# EAGLE schematic lora_mcu (EAGLE 9.5.2)
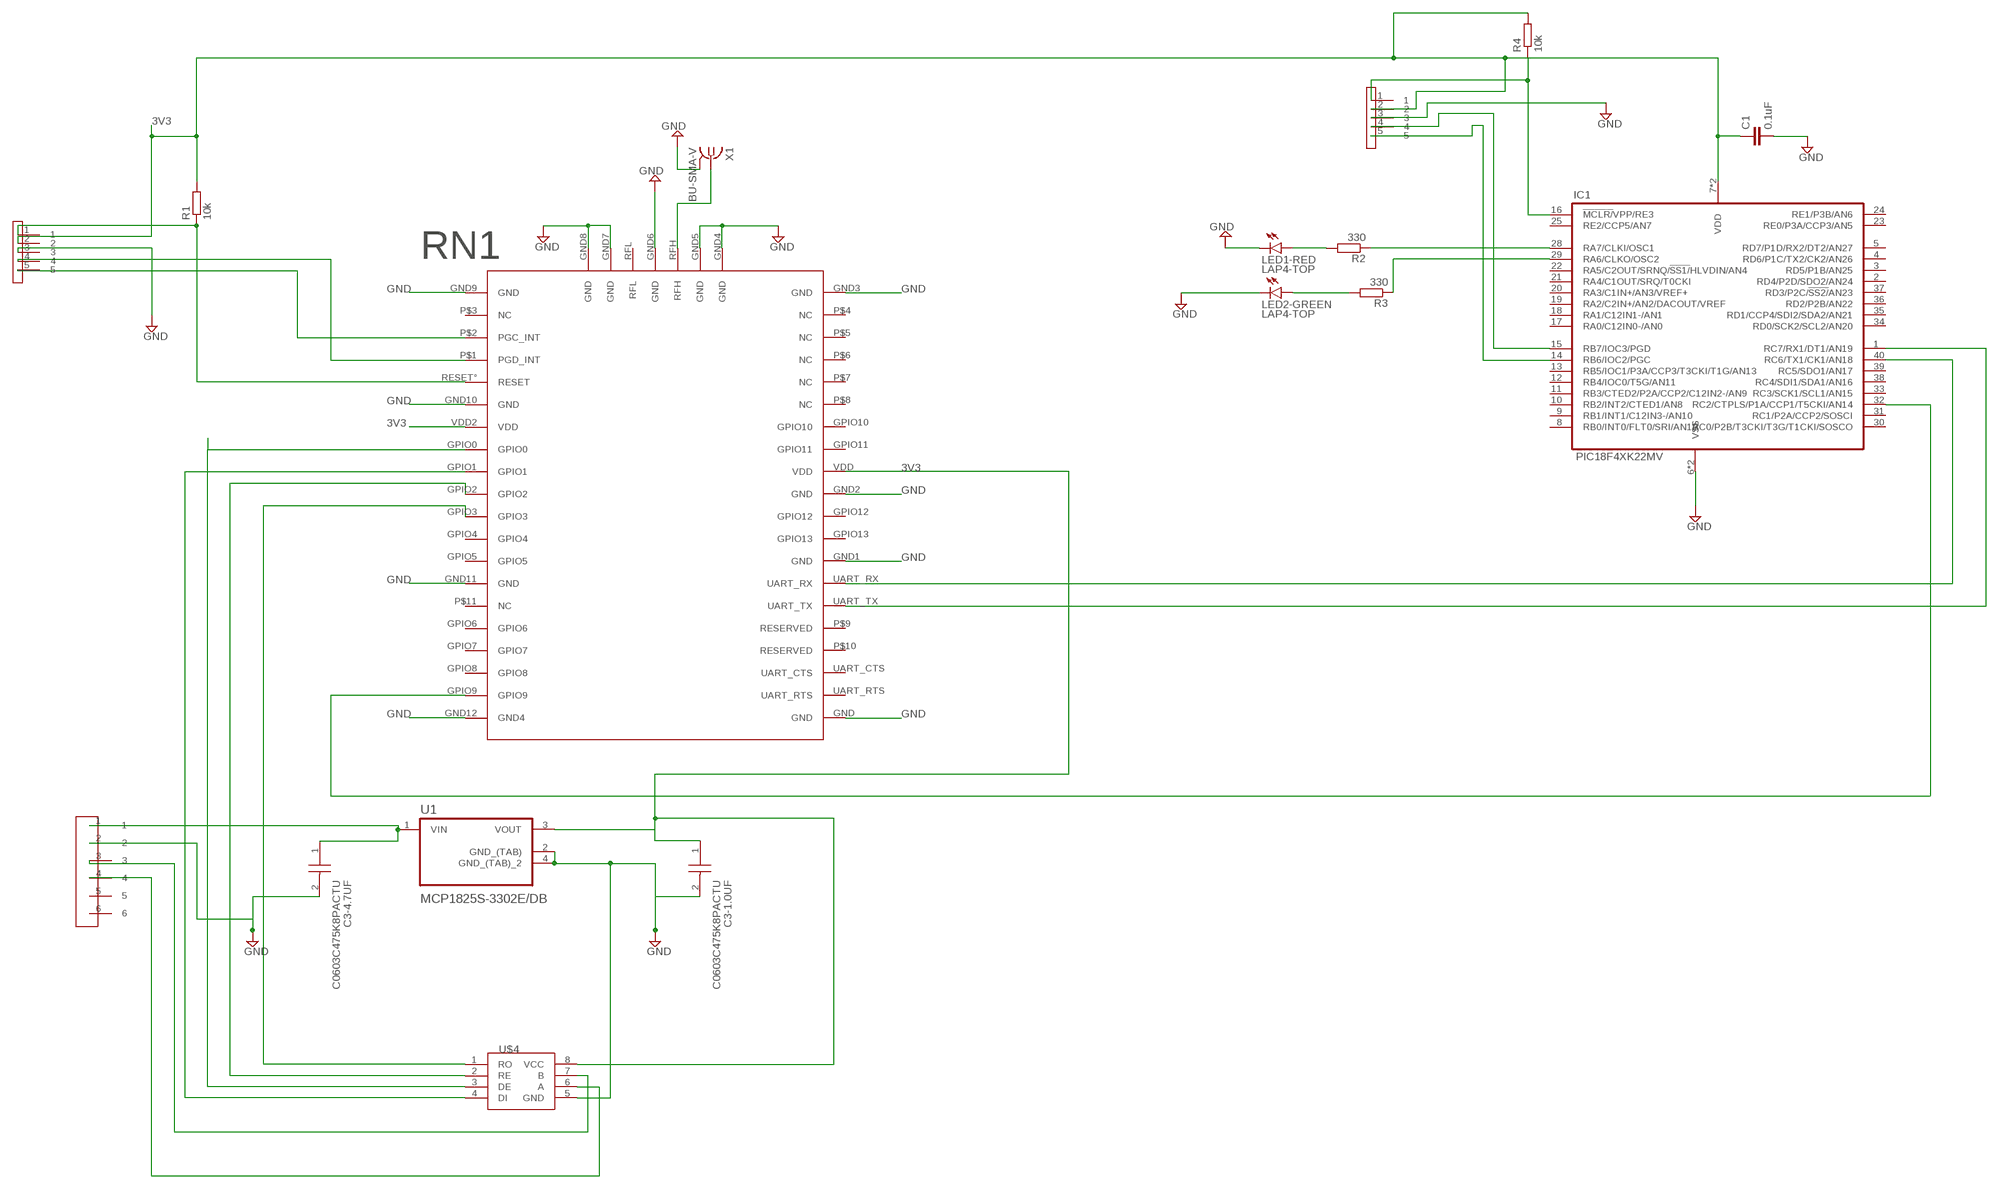
[diagram p0: schematic, sheet 1]

## Parts
C1  0.1uF  C2,5-3  [C2.5-3]
C3-1.0UF  C0603C475K8PACTU  [CAPC1608X85N]
C3-4.7UF  C0603C475K8PACTU  [CAPC1608X85N]
IC1  PIC18F4XK22MV  [UQFN40ML5X5MM]
LED1-RED  LAP4-TOP  [P47F-TOP]
LED2-GREEN  LAP4-TOP  [P47F-TOP]
R1  10k  R-EU_R0603  [R0603]
R2  330  R-EU_R0603  [R0603]
R3  330  R-EU_R0603  [R0603]
R4  10k  R-EU_R0603  [R0603]
RN1  NEW_RN2483  [NEW_RN2483]
U1  MCP1825S-3302E/DB  [SOT230P700X180-4N]
U$1  CONNECTOR6  [CONNECTOR6]
U$2  ICSP5  [ICSP]
U$3  ICSP5  [ICSP]
U$4  AMD3485E  [AMD3485E]
X1  BU-SMA-V  [BU-SMA-V]

## Nets
3V3: C1.1 C3-1.0UF.1(C1) IC1.7(VDD) IC1.26(VDD) R1.2 R4.2 RN1.VDD RN1.VDD2(VDD) U1.3(VOUT) U$2.2 U$3.2 U$4.8(VCC)
GND: C1.2 C3-1.0UF.2(C2) C3-4.7UF.2(C2) IC1.6(VSS) IC1.27(VSS) LED1-RED.C LED2-GREEN.C RN1.GND RN1.GND1(GND) RN1.GND2(GND) RN1.GND3(GND) RN1.GND4(GND) RN1.GND5(GND) RN1.GND6(GND) RN1.GND7(GND) RN1.GND8(GND) RN1.GND9(GND) RN1.GND10(GND) RN1.GND11(GND) RN1.GND12(GND4) U1.2(GND_(TAB)) U1.4(GND_(TAB)_2) U$1.2 U$2.3 U$3.3 U$4.5(GND) X1.2 X1.3 X1.4 X1.5
N$1: RN1.P$2(PGC_INT) U$2.5
N$2: RN1.P$1(PGD_INT) U$2.4
N$3: R1.1 RN1.RESET°(RESET) U$2.1
N$4: RN1.RFH X1.1
N$5: LED1-RED.A R2.2
N$6: LED2-GREEN.A R3.2
N$7: IC1.15(RB7/IOC3/PGD) U$3.4
N$8: C3-4.7UF.1(C1) U1.1(VIN) U$1.1
N$9: IC1.40(RC6/TX1/CK1/AN18) RN1.UART_RX
N$10: IC1.14(RB6/IOC2/PGC) U$3.5
N$11: IC1.16(!MCLR/!VPP/RE3) R4.1 U$3.1
N$12: IC1.29(RA6/CLKO/OSC2) R3.1
N$13: IC1.28(RA7/CLKI/OSC1) R2.1
N$14: IC1.1(RC7/RX1/DT1/AN19) RN1.UART_TX
N$15: IC1.32(RC2/CTPLS/P1A/CCP1/T5CKI/AN14) RN1.GPIO9
N$16: U$1.3 U$4.7(B)
N$17: U$1.4 U$4.6(A)
N$18: RN1.GPIO3 U$4.1(RO)
N$19: RN1.GPIO2 U$4.2(RE)
N$20: RN1.GPIO0 U$4.3(DE)
N$21: RN1.GPIO1 U$4.4(DI)
Unconnected: IC1.2(RD4/P2D/SDO2/AN24) IC1.3(RD5/P1B/AN25) IC1.4(RD6/P1C/TX2/CK2/AN26) IC1.5(RD7/P1D/RX2/DT2/AN27) IC1.8(RB0/INT0/FLT0/SRI/AN12) IC1.9(RB1/INT1/C12IN3-/AN10) IC1.10(RB2/INT2/CTED1/AN8) IC1.11(RB3/CTED2/P2A/CCP2/C12IN2-/AN9) IC1.12(RB4/IOC0/T5G/AN11) IC1.13(RB5/IOC1/P3A/CCP3/T3CKI/T1G/AN13) IC1.17(RA0/C12IN0-/AN0) IC1.18(RA1/C12IN1-/AN1) IC1.19(RA2/C2IN+/AN2/DACOUT/VREF) IC1.20(RA3/C1IN+/AN3/VREF+) IC1.21(RA4/C1OUT/SRQ/T0CKI) IC1.22(RA5/C2OUT/SRNQ/!SS1/!HLVDIN/AN4) IC1.23(RE0/P3A/CCP3/AN5) IC1.24(RE1/P3B/AN6) IC1.25(RE2/CCP5/AN7) IC1.30(RC0/P2B/T3CKI/T3G/T1CKI/SOSCO) IC1.31(RC1/P2A/CCP2/SOSCI) IC1.33(RC3/SCK1/SCL1/AN15) IC1.34(RD0/SCK2/SCL2/AN20) IC1.35(RD1/CCP4/SDI2/SDA2/AN21) IC1.36(RD2/P2B/AN22) IC1.37(RD3/P2C/!SS2/!AN23) IC1.38(RC4/SDI1/SDA1/AN16) IC1.39(RC5/SDO1/AN17) RN1.GPIO4 RN1.GPIO5 RN1.GPIO6 RN1.GPIO7 RN1.GPIO8 RN1.GPIO10 RN1.GPIO11 RN1.GPIO12 RN1.GPIO13 RN1.P$3(NC) RN1.P$4(NC) RN1.P$5(NC) RN1.P$6(NC) RN1.P$7(NC) RN1.P$8(NC) RN1.P$9(RESERVED) RN1.P$10(RESERVED) RN1.P$11(NC) RN1.RFL RN1.UART_CTS RN1.UART_RTS U$1.5 U$1.6

## Library data of the parts
C1 = capacitor-wima:C: CAPACITOR naming: grid - package width
C3-1.0UF C3-4.7UF = C0603C475K8PACTU:C0603C475K8PACTU: CAPACITOR, 0603 4.7uF +/-10% 10V Source: Datasheet <http://componentsearchengine.com/Datasheets/1/C0603C475K8PACTU.pdf>; ARROW_PART_NUMBER: C0603C475K8PACTU; ARROW_PRICE-STOCK: https://www.arrow.com/en/products/c0603c475k8pactu/kemet-corporation; DESCRIPTION: CAPACITOR, 0603 4.7uF +/-10% 10V; HEIGHT: mm; MANUFACTURER_NAME: Kemet; MANUFACTURER_PART_NUMBER: C0603C475K8PACTU; MOUSER_PART_NUMBER: 80-C0603C475K8P; MOUSER_PRICE-STOCK: https://www.mouser.co.uk/ProductDetail/KEMET/C0603C475K8PACTU?qs=K%2Fj%2Fqf%252B0fqK6lAUxhlPmKA%3D%3D
IC1 = microchip-pic18f4xk22:PIC18F4XK22: The library has been designed by Richard Magdycz <https://www.facebook.com/groups/eaglecadsoftUK>
LED1-RED LED2-GREEN = led:*P4: PointLED® Enhanced Thinfilm LED TOP & BOTTOM mount LS P47F, LR P47F, LA P47F, LY P47F, LT P4SG, LB P4SG, LW P4SG Source: http://catalog.osram-os.com .. LA_LR_LS_LY_P47F_Pb_free.pdf
R1-R4 = rcl:R-EU_: RESISTOR, European symbol; SPICEPREFIX: R
RN1 = tobias:NEW_RN2483
U1 = MCP1825S-3302E_DB:MCP1825S-3302E/DB; AVAILABILITY: Unavailable; DESCRIPTION: Linear Voltage Regulator IC 1 Output 500mA SOT-223-3; MF: Microchip; MP: MCP1825S-3302E/DB; PACKAGE: SOT-223 Microchip; PRICE: None
U$1 = conn4:CONNECTOR6
U$2 U$3 = conn4:ICSP5
U$4 = AMD3485E:AMD3485E
X1 = con-coax:BU-SMA-V: FEMALE SMA CONNECTOR Radiall distributor RS 112-3794; OC_FARNELL: unknown; OC_NEWARK: unknown